# Altium schematic sheet PumpTimerV2.SchDoc
size A
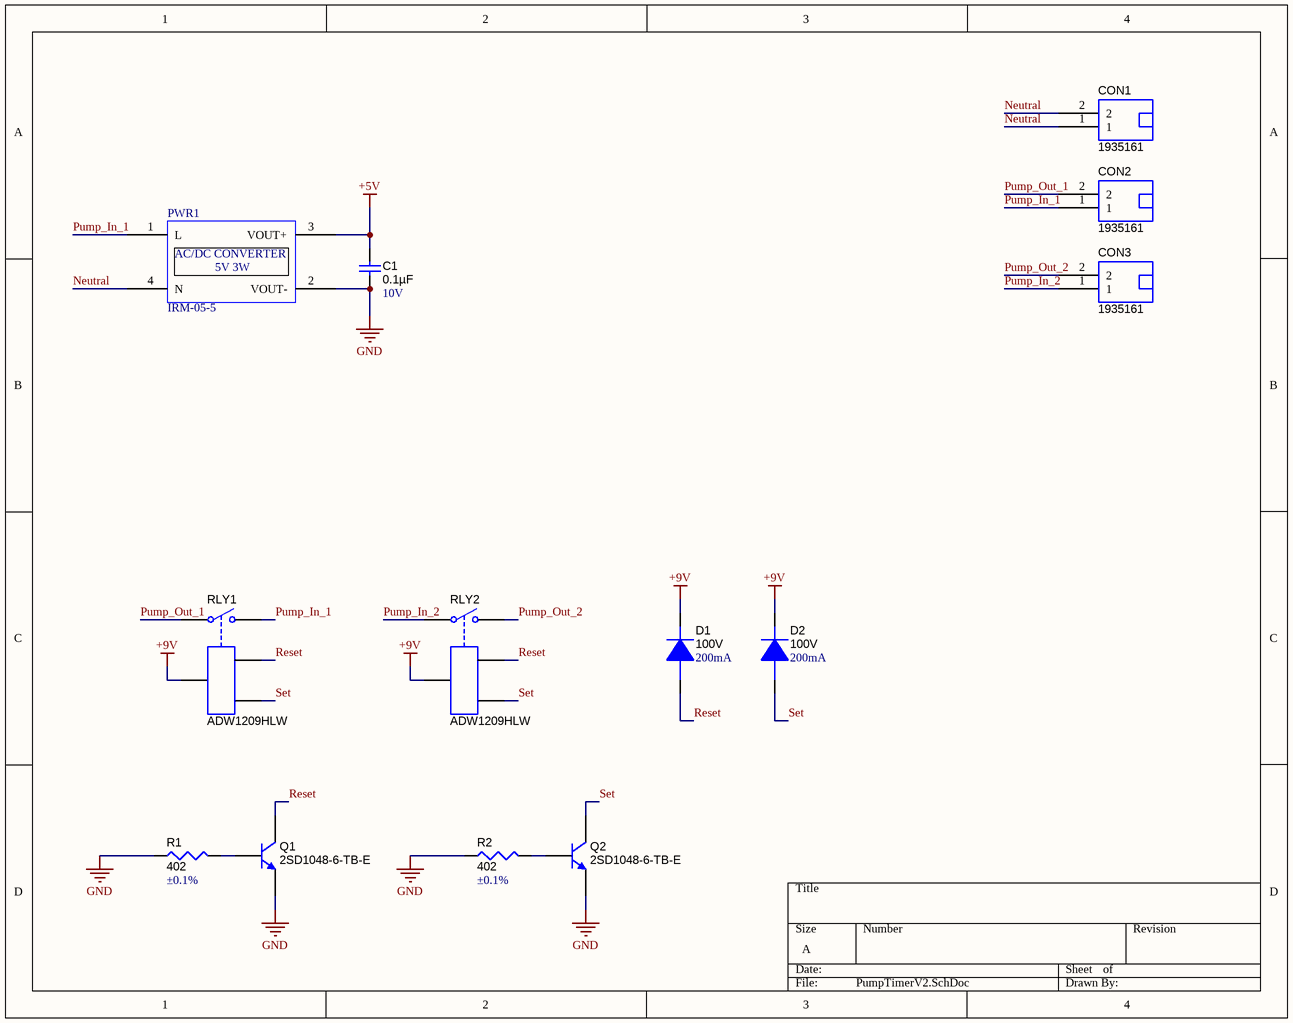
[diagram p0: PumpTimerV2.SchDoc]

## Parts
C1  0.1µF  Parameters: 10V  [0402_C]
CON1  1935161  [5MM-CON-2]
CON2  1935161  [5MM-CON-2]
CON3  1935161  [5MM-CON-2]
D1  100V  Parameters: 200mA  [SOD123]
D2  100V  Parameters: 200mA  [SOD123]
PWR1  IRM-05-5  [RAC03-05SK]
Q1  2SD1048-6-TB-E  [SOT-23]
Q2  2SD1048-6-TB-E  [SOT-23]
R1  402  Parameters: ±0.1%  [0805_R]
R2  402  Parameters: ±0.1%  [0805_R]
RLY1  ADW1209HLW  [ADW1 LOW-PROFILE RELAY]
RLY2  ADW1209HLW  [ADW1 LOW-PROFILE RELAY]

## Nets
+5V: C1.2 PWR1.3(VOUT+)
+9V: D1.2(K) D2.2(K) RLY1.2 RLY2.2
GND: C1.1 PWR1.2(VOUT-) Q1.E Q2.E R1.1 R2.1
Neutral: CON1.1 CON1.2 PWR1.4(N)
Pump_In_1: CON2.1 PWR1.1(L) RLY1.4
Pump_In_2: CON3.1 RLY2.5
Pump_Out_1: CON2.2 RLY1.5
Pump_Out_2: CON3.2 RLY2.4
Reset: D1.1(A) Q1.C RLY1.3 RLY2.3
Set: D2.1(A) Q2.C RLY1.1 RLY2.1
NetQ1_B: Q1.B R1.2
NetQ2_B: Q2.B R2.2

## Notes on the sheet
- (in symbol 9854) AC/DC CONVERTER; 5V 3W

## Library data of the parts
C1 = 5433: CAP CER 0.1UF 10V 10% X7R 0402; Manufacturer Part Number: C1005X7R1A104K050BB; Manufacturer: TDK Corporation; Part Category: Capacitors; Part Verified: False; Internal PN: 5433; Cost 1pc: 0.1; Cost 100pc: 0.0121; Cost 1000pc: 0.0066; Primary Vendor Stock: 617771; Current Inventory: 0; SLInvtID: PDI-05433; Value: 0.1µF; Supplier Part Number 1: 445-4958-1-ND; Supplier 1: Digi-Key; RoHS Compliant: True; Simulation: CAP; ComponentLink1Description: Datasheet Document; Signal Integrity: Cap
CON1-CON3 = 9497: 2 POSITION SCREW TERMINAL WIRE TO BOARD TERMINAL BLOCK HORIZONTAL WITH BOARD 0.197" (5.00MM) THROUGH HOLE; Manufacturer: Phoenix Contact; Part Category: Connectors; Part Verified: False; Internal PN: 9497; Cost 1pc: 0.43; Cost 100pc: 0.38; Cost 1000pc: 0.3; Primary Vendor Stock: 0; Current Inventory: 15956; SLInvtID: PDI-09497; Manufacturer Part Number: 1935161; Supplier Part Number 1: 277-1667-ND; Supplier 1: Digi-Key; RoHS Compliant: False; Value: 1935161; ComponentLink1Description: Datasheet Document
D1 D2 = 9142: DIODE GEN PURP 100V 200MA SOD123; Manufacturer Part Number: MMSD914T1G; Manufacturer: ON Semiconductor; Part Category: Diodes; Part Verified: False; Internal PN: 9142; Cost 1pc: 0.2; Cost 100pc: 0.0998; Cost 1000pc: 0.04186; Primary Vendor Stock: 0; SLInvtID: PDI-09142; Supplier Part Number 1: MMSD914T1GOSCT-ND; Supplier 1: Digi-Key; RoHS Compliant: True; Value: 100V; ComponentLink1Description: Datasheet Document; Current Inventory: 0
PWR1 = 9854: AC/DC CONVERTER 5V 3W; Manufacturer: Recom Power; Part Category: Power Supplies; Part Verified: False; Internal PN: 9854; Cost 1pc: 6.63; Cost 100pc: 5.87; Cost 1000pc: 5.3; Primary Vendor Stock: 0; SLInvtID: PDI-09854; Manufacturer Part Number: RAC03-05SK; Supplier Part Number 1: 945-3441-ND; Supplier 1: Digi-Key; RoHS Compliant: False; Value: IRM-05-5; ComponentLink1Description: Datasheet Document; Current Inventory: 0
Q1 Q2 = 9500: BIPOLAR (BJT) TRANSISTOR NPN 15V 700MA 250MHZ 200MW SURFACE MOUNT 3-CP; Manufacturer: ON Semiconductor; Part Category: Discrete Semiconductor Products; Part Verified: False; Internal PN: 9500; Cost 1pc: 0.37; Cost 100pc: 0.13; Cost 1000pc: 0.09; Primary Vendor Stock: 0; Current Inventory: 8401; SLInvtID: PDI-09500; Manufacturer Part Number: 2SD1048-6-TB-E; Supplier Part Number 1: 2SD1048-6-TB-EOSCT-ND; Supplier 1: Digi-Key; RoHS Compliant: False; Value: 2SD1048-6-TB-E; ComponentLink1Description: Datasheet Document
R1 R2 = 365: RES 402 OHM 1/10W .1% 0805 SMD; Manufacturer Part Number: RR1220P-4020-B-M-T5; Manufacturer: Susumu; Part Category: Resistors; Part Verified: False; Internal PN: 365; Cost 1pc: 0; SLInvtID: PDI-00365; Value: 402; Supplier Part Number 1: (obsolete) RR12P402BCT-ND; Supplier 1: Digi-Key; RoHS Compliant: True; Cost 100pc: 0; Cost 1000pc: 0; Primary Vendor Stock: 0; Simulation: RESISTOR; ComponentLink1Description: Datasheet Document; Current Inventory: 0; Signal Integrity: Res
RLY1 RLY2 = 9495: GENERAL PURPOSE TWO-COIL RELAY SPST-NO (1 FORM A) 9VDC COIL THROUGH HOLE; Manufacturer: Panasonic - ECG; Part Category: Relays; Part Verified: False; Internal PN: 9495; Cost 1pc: 5.83; Cost 100pc: 4.37; Cost 1000pc: 3.4; Primary Vendor Stock: 0; Current Inventory: 131; SLInvtID: PDI-09495; Manufacturer Part Number: ADW1209HLW; Supplier Part Number 1: 255-5339-ND; Supplier 1: Digi-Key; RoHS Compliant: False; Value: ADW1209HLW; ComponentLink1Description: Datasheet Document